# EasyEDA schematic esp_teleinfo.json
TITLE: New Schematic; REV: 1.0; Date: 2018-12-04; Sheet: 1/1; Drawn By: sbarthelemy
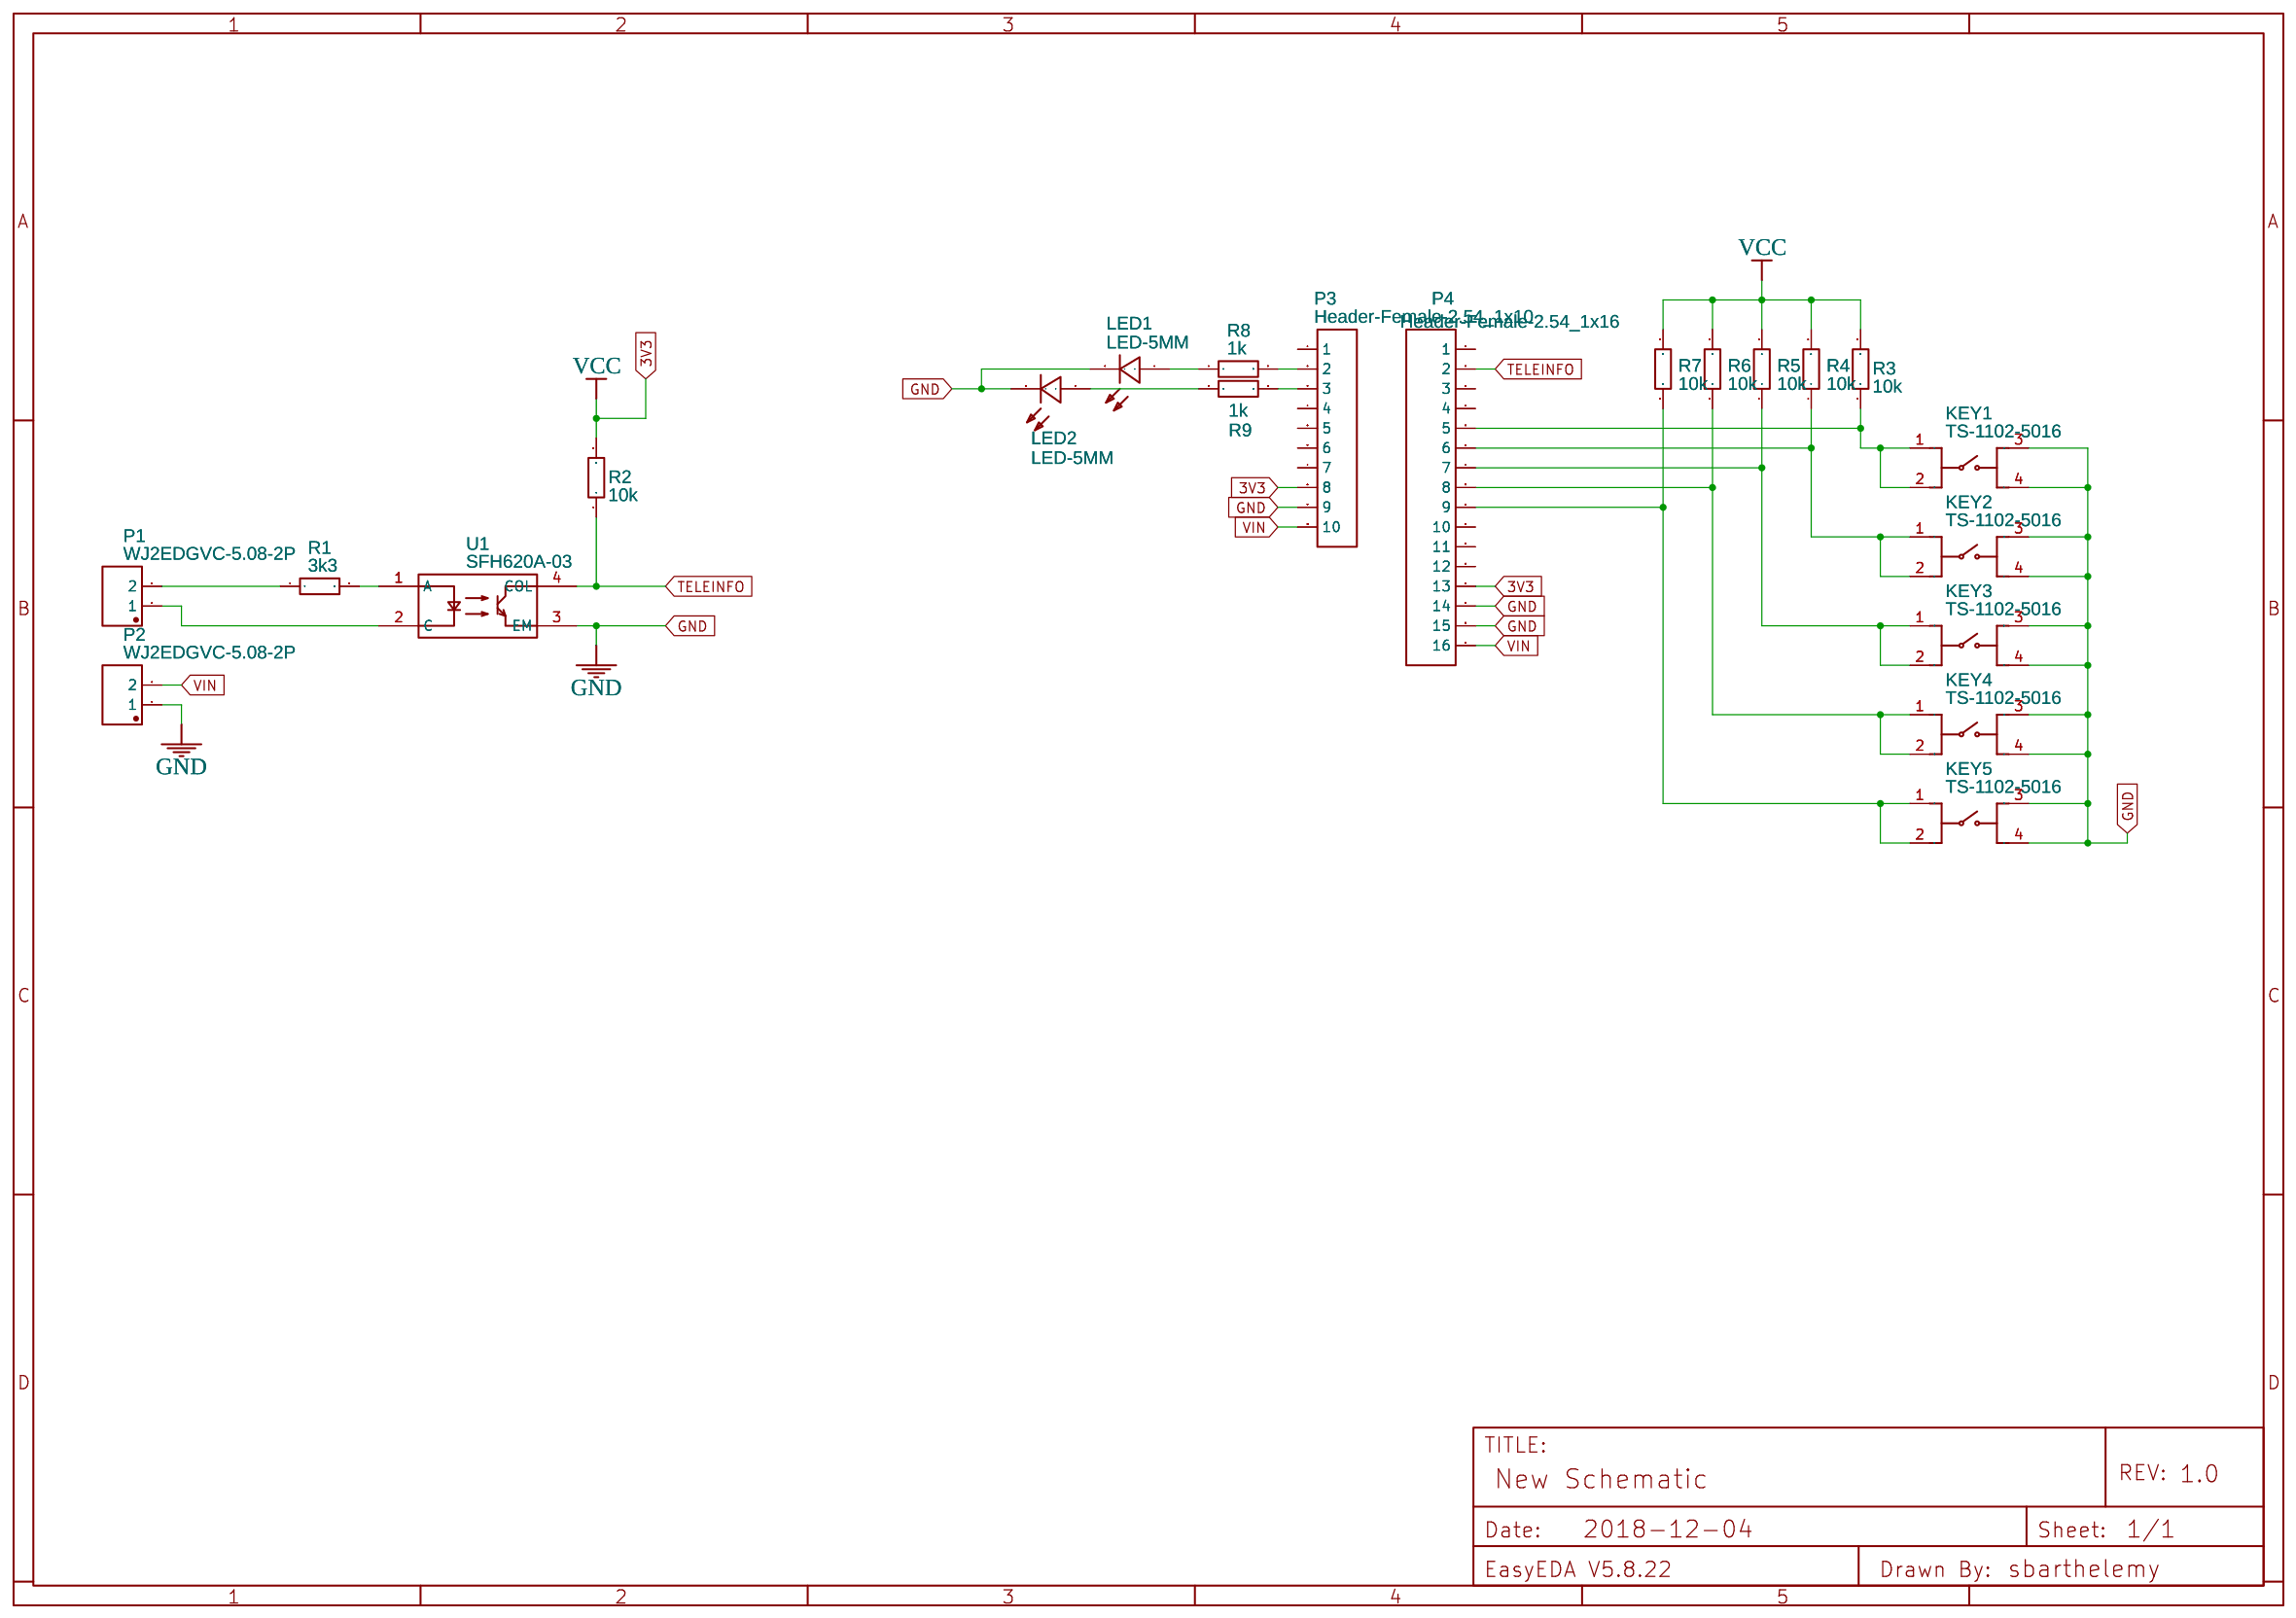
[diagram p0: schematic sheet]

## Parts
KEY1  TS-1102-5016  [KEY-6.0*6.0-2]
KEY2  TS-1102-5016  [KEY-6.0*6.0-2]
KEY3  TS-1102-5016  [KEY-6.0*6.0-2]
KEY4  TS-1102-5016  [KEY-6.0*6.0-2]
KEY5  TS-1102-5016  [KEY-6.0*6.0-2]
LED1  LED-5MM  [LED-5MM/2.54]
LED2  LED-5MM  [LED-5MM/2.54]
P1  WJ2EDGVC-5.08-2P  [WJ2EDGVC-5.08-2P]
P2  WJ2EDGVC-5.08-2P  [WJ2EDGVC-5.08-2P]
P3  Header-Female-2.54_1x10  [HDR-10X1/2.54]
P4  Header-Female-2.54_1x16  [HDR-16X1/2.54]
R1  3k3  [AXIAL-0.3]
R2  10k  [AXIAL-0.3]
R3  10k  [AXIAL-0.3]
R4  10k  [AXIAL-0.3]
R5  10k  [AXIAL-0.3]
R6  10k  [AXIAL-0.3]
R7  10k  [AXIAL-0.3]
R8  1k  [AXIAL-0.3]
R9  1k  [AXIAL-0.3]
U1  SFH620A-03  [DIP-4]

## Library data of the parts
KEY1-KEY5 = -: Supplier: LCSC; Manufacturer: SOFNG; Contributor: EasyEDA; Supplier Part: C111609
LED1 LED2 = -: Supplier: LCSC; Manufacturer: EVERLIGHT; Manufacturer Part: 5AR2ST10; Supplier Part: C52721
P1 P2 = -: Supplier: LCSC; Manufacturer: ReliaPro; image: //image.lceda.cn/szlcsc/C8445.jpg; Supplier Part: C8445
P3 = -: Supplier: LCSC; Manufacturer: BOOMELE; Manufacturer Part: 2.54mm 1*10P Straight Female header Gold-plated; Supplier Part: C35445
P4 = -: Supplier: LCSC; Manufacturer: BOOMELE; Manufacturer Part: Female header1*16P pitch 2.54mm; image: //image.lceda.cn/szlcsc/C66987.jpg; Supplier Part: C66987
R1-R9 = Res_AXIAL-0.3(1/8W)_EU: Manufacturer Part: ?
U1 = -: Supplier: LCSC; Manufacturer: VISHAY; Manufacturer Part: SFH617A-4X016; Contributor: LCSC; Supplier Part: C145216

## Nets
3V3: P3.8 P4.13 R2.2 R3.2 R4.2 R5.2 R6.2 R7.2
GND: KEY1.3 KEY1.4 KEY2.3 KEY2.4 KEY3.3 KEY3.4 KEY4.3 KEY4.4 KEY5.3 KEY5.4 LED1.2(-) LED2.2(-) P2.1 P3.9 P4.14 P4.15 U1.3(EM)
VIN: P2.2 P3.10 P4.16
TELEINFO: P4.2 R2.1 U1.4(COL)
Net-(KEY1-1): KEY1.1 KEY1.2 P4.5 R3.1
Net-(KEY2-1): KEY2.1 KEY2.2 P4.6 R4.1
Net-(KEY3-1): KEY3.1 KEY3.2 P4.7 R5.1
Net-(KEY4-1): KEY4.1 KEY4.2 P4.8 R6.1
Net-(KEY5-1): KEY5.1 KEY5.2 P4.9 R7.1
Net-(LED1-1): LED1.1(+) R8.1
Net-(LED2-1): LED2.1(+) R9.1
Net-(P1-1): P1.1 U1.2(C)
Net-(P1-2): P1.2 R1.1
Net-(P3-2): P3.2 R8.2
Net-(P3-3): P3.3 R9.2
Net-(R1-2): R1.2 U1.1(A)

Not connected (* = marked no-connect by the designer): P3 1 4 5 6 7; P4 1 3 4 10 11 12
